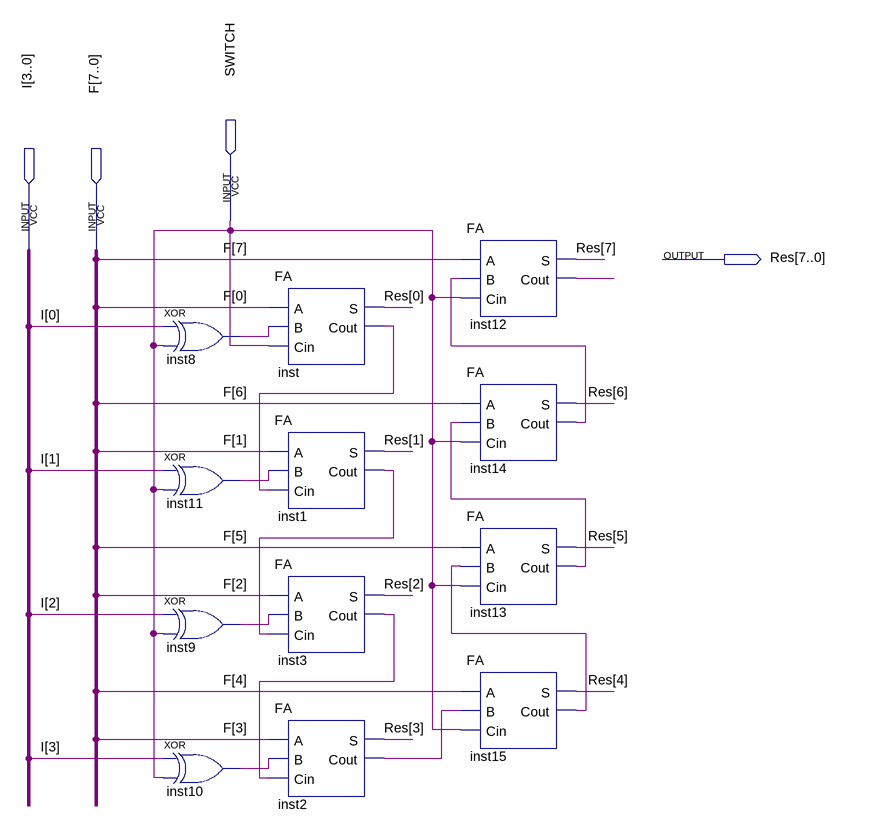
[diagram p0: schematic sheet]
// Quartus schematic Adder8_4bits.bdf as structural Verilog: 12 symbols, 4 pins
module Adder8_4bits (
  input  SWITCH,
  input  [3:0] I,
  input  [7:0] F,
  output [7:0] Res
);

  wire inst1_cout, inst2_cout, inst3_cout, inst8_out, inst9_out, inst10_out, inst11_out, inst12_cout,
       inst13_cout, inst14_cout, inst15_cout, inst_cout;

  xor inst8 (inst8_out, I[0], SWITCH);
  xor inst11 (inst11_out, I[1], SWITCH);
  xor inst9 (inst9_out, I[2], SWITCH);
  xor inst10 (inst10_out, I[3], SWITCH);
  FA inst (.A(F[0]), .B(inst8_out), .Cin(SWITCH), .S(Res[0]), .Cout(inst_cout));
  FA inst1 (.A(F[1]), .B(inst11_out), .Cin(inst_cout), .S(Res[1]), .Cout(inst1_cout));
  FA inst3 (.A(F[2]), .B(inst9_out), .Cin(inst1_cout), .S(Res[2]), .Cout(inst3_cout));
  FA inst2 (.A(F[3]), .B(inst10_out), .Cin(inst3_cout), .S(Res[3]), .Cout(inst2_cout));
  FA inst12 (.A(F[7]), .B(inst14_cout), .Cin(SWITCH), .S(Res[7]), .Cout(inst12_cout));
  FA inst14 (.A(F[6]), .B(inst13_cout), .Cin(SWITCH), .S(Res[6]), .Cout(inst14_cout));
  FA inst13 (.A(F[5]), .B(inst15_cout), .Cin(SWITCH), .S(Res[5]), .Cout(inst13_cout));
  FA inst15 (.A(F[4]), .B(inst2_cout), .Cin(SWITCH), .S(Res[4]), .Cout(inst15_cout));
endmodule
